# Altium schematic sheet USB_TO_UART_CONVERTER.SchDoc
size A; SheetNumber: 4; SheetTotal: 8
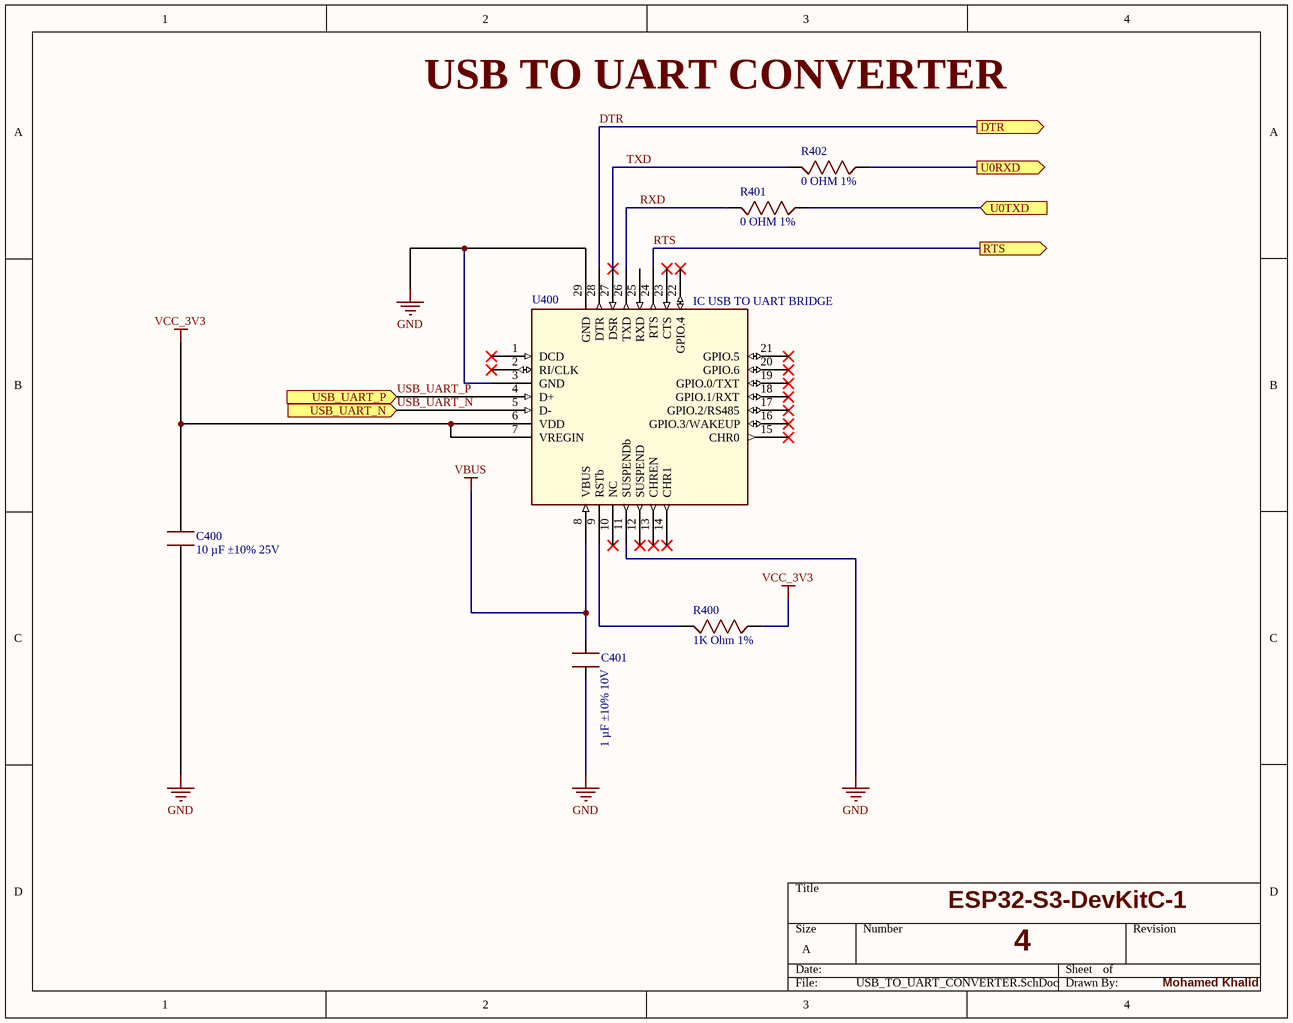
[diagram p0: USB_TO_UART_CONVERTER.SchDoc]

## Parts
C400  10 µF ±10% 25V  [CAPC2012X145N]
C401  1 µF ±10% 10V  [CAPC1608X90N]
R400  1K Ohm 1%  [RESC2012X65N]
R401  0 OHM 1%  [RESC2012X65N]
R402  0 OHM 1%  [RESC2012X65N]
U400  IC USB TO UART BRIDGE  [QFN28_5X5_SIL]

## Ports
DTR (out, see AUTO_PROGRAMMING[1B]), RTS (out, see AUTO_PROGRAMMING[1C]), U0RXD (out, see ESP32-S3-WROOM-1U[3B], PIN-HEADERS[3B]), U0TXD (in, see ESP32-S3-WROOM-1U[3B], PIN-HEADERS[3B]), USB_UART_N (in, see USB[4C]), USB_UART_P (in, see USB[4C])

## Nets
GND: C400.1 C401.1 U400.3(GND) U400.11(SUSPENDb) U400.29(GND)
VBUS: C401.2 U400.8(VBUS)
VCC_3V3: C400.2 R400.2 U400.6(VDD) U400.7(VREGIN)
DTR: U400.28(DTR) ; port DTR
RTS: U400.24(RTS) ; port RTS
RXD: R401.1 U400.26(TXD)
TXD: R402.1 U400.27(DSR)
U0RXD: R402.2 ; port U0RXD
U0TXD: R401.2 ; port U0TXD
USB_UART_N: U400.5(D-) ; port USB_UART_N
USB_UART_P: U400.4(D+) ; port USB_UART_P
NetR400_1: R400.1 U400.9(RSTb)

Not connected (* = marked no-connect by the designer): U400 1(DCD)* 2(RI/CLK)* 10(NC)* 12(SUSPEND)* 13(CHREN)* 14(CHR1)* 15(CHR0)* 16(GPIO.3/WAKEUP)* 17(GPIO.2/RS485)* 18(GPIO.1/RXT)* 19(GPIO.0/TXT)* 20(GPIO.6)* 21(GPIO.5)* 22(GPIO.4)* 23(CTS)* 25(RXD)

## Notes on the sheet
- USB TO UART CONVERTER
- ESP32-S3-DevKitC-1
- 4
- Mohamed Khalid

## Library data of the parts
C400 = CL21A106KAYNNNE: 10 µF ±10% 25V Ceramic Capacitor X5R 0805 (2012 Metric); Value: 10 µF; Tolerance: ±10%; Voltage - Rated: 25V
C401 = CL10B105KP8NNNC: 1 µF ±10% 10V Ceramic Capacitor X7R 0603 (1608 Metric); Value: 1 µF; Tolerance: ±10%; Voltage - Rated: 10 V
R400 = RMCF0805FT1K00: 1 kOhms ±1% 0.125W, 1/8W Chip Resistor 0805 (2012 Metric) Automotive AEC-Q200 Thick Film; Value: 1K OHM; Tolerance: ± 1%; Power (Watts): 0.125W, 1/8W
R401 R402 = RMCF0805FT10K0: 10 kOhms ±1% 0.125W, 1/8W Chip Resistor 0805 (2012 Metric) Automotive AEC-Q200 Thick Film; Value: 10 kOhms; Tolerance: ±1%; Power (Watts): 1/8W
U400 = CP2102N-A02-GQFN28: USB Bridge, USB to UART USB 2.0 UART Interface 28-QFN (5x5); Standards: USB 2.0; Voltage - Supply: 3V ~ 3.6V; Current - Supply: 9.5mA; Protocol: USB; Function: Bridge, USB to UART